# EAGLE board headstage-64_via-reduce (EAGLE 8.3.2), part 1 of 2
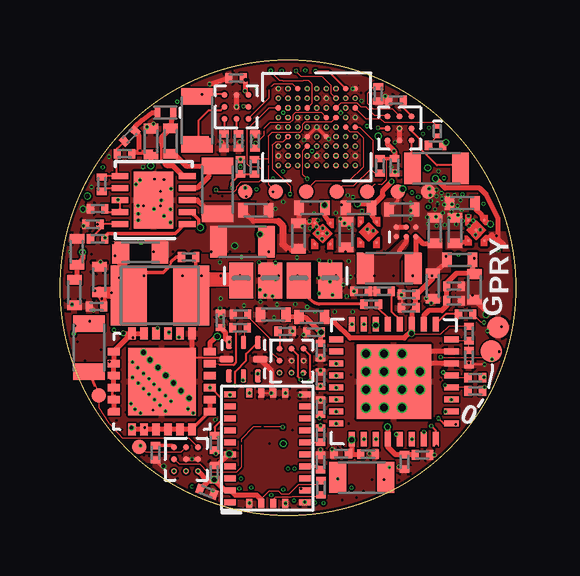
[diagram p5: board, top side]
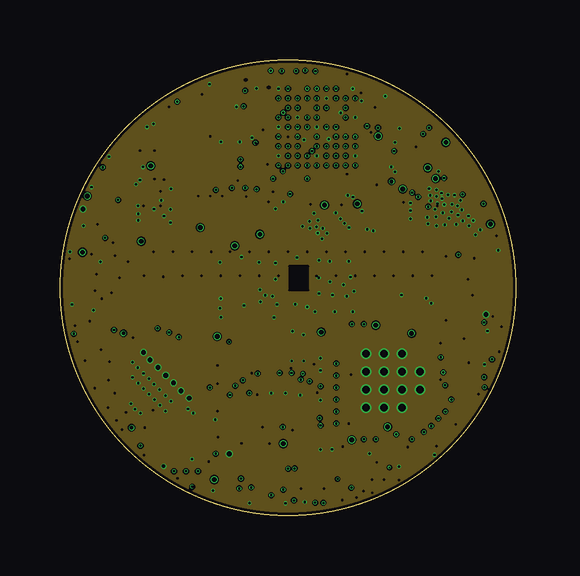
[diagram p6: board, inner layer GND1]
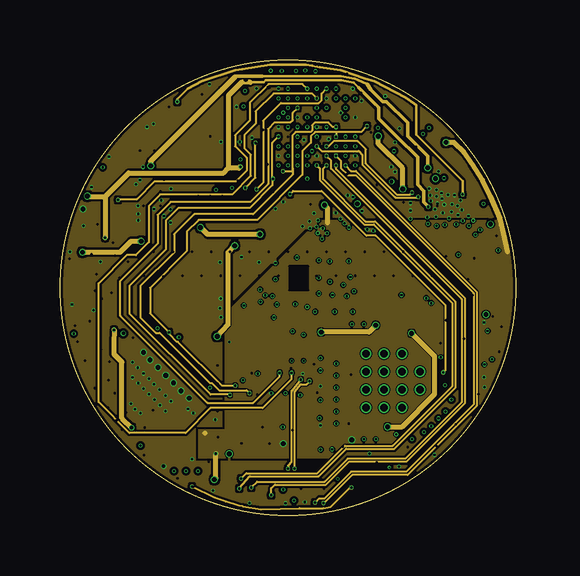
[diagram p7: board, inner layer Route2/PWR]
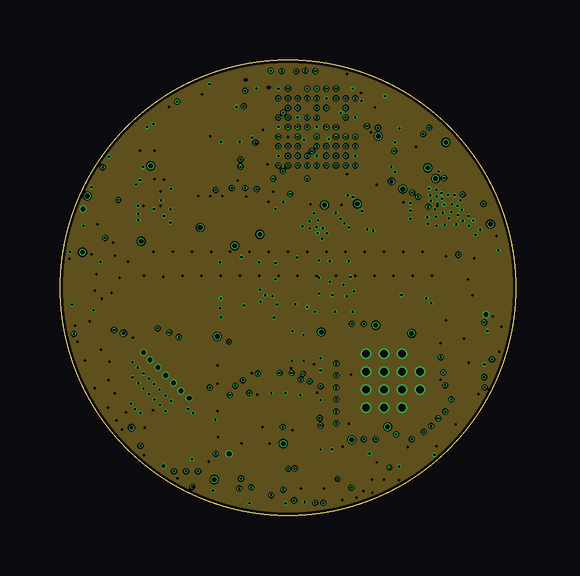
[diagram p8: board, inner layer GND2]
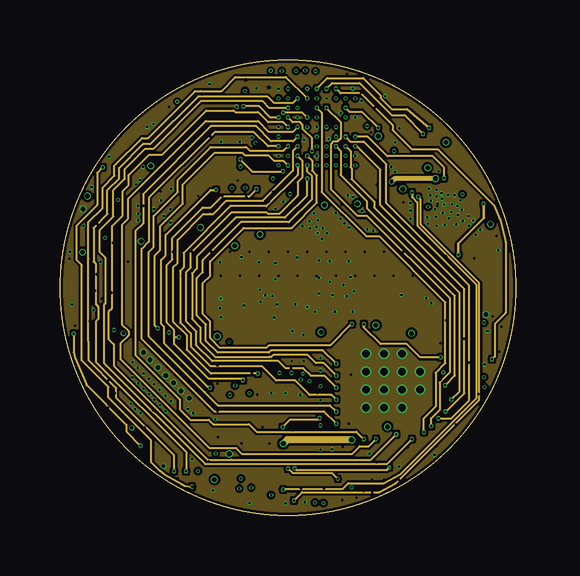
[diagram p9: board, inner layer Route3]
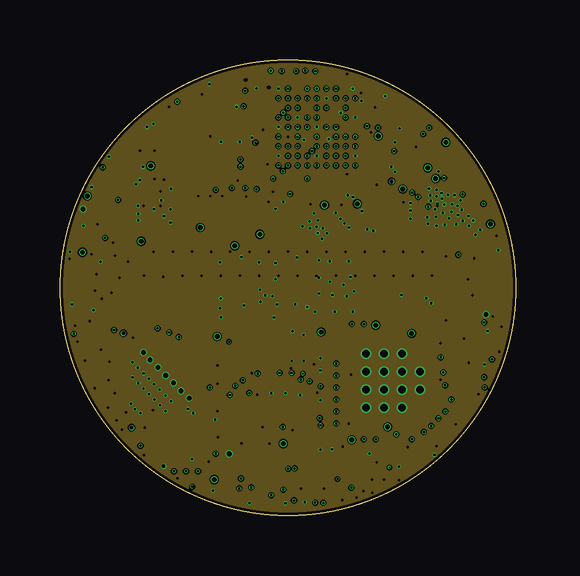
[diagram p10: board, inner layer GND3]
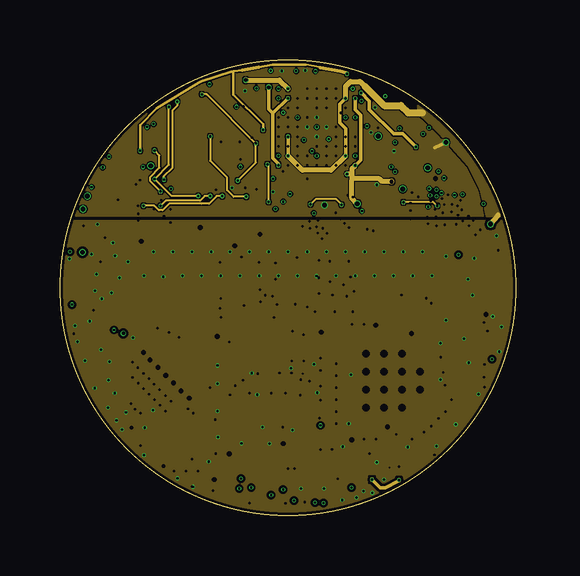
[diagram p11: board, inner layer AGND/PWR]
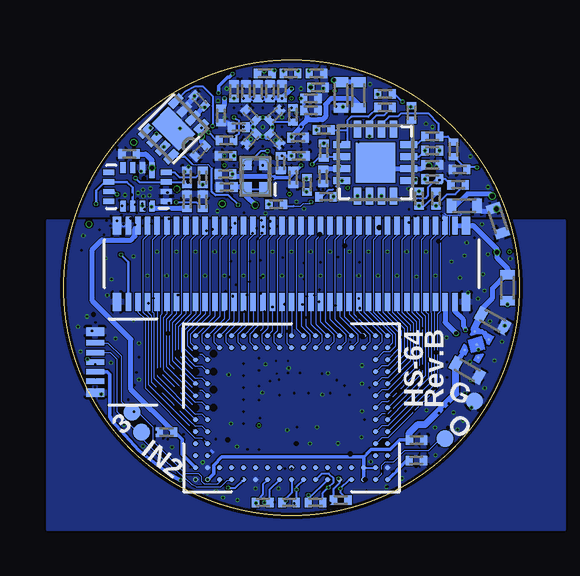
[diagram p12: board, bottom side, seen from below]

Size 19 x 19 mm. Coordinates in mm from the lower left corner, seen from the top.
Outline: circle at 9.5,9.5 radius 9.5
Copper layers ((1*2*3*4*5*6)+(7*16)): Top 0.036mm / dielectric 4mil / GND1 0.036mm / dielectric 5mil / Route2/PWR 0.036mm / dielectric 0.10921875mm / GND2 0.036mm / dielectric 5mil / Route3 0.036mm / dielectric 4mil / GND3 0.035mm / dielectric 0.15mm / AGND/PWR 0.035mm / dielectric 0.2mm / Bottom 0.036mm
Design rules "headstage-256 *": minimum track width 2mil, minimum drill 3mil, track to track 2mil, track to pad 2mil, pad to pad 2mil, via to via 2mil, smd to smd 2mil, copper to edge 5mil, drill to drill 5mil, minimum pad ring 2mil, minimum via ring 1mil, stop-mask expansion 1mil, vias tented up to drill 1mm, thermal gap 4mil
Net classes: 1 thick: width 0.1 mm; 2 diff: width 0.076 mm, drill 0.1 mm, clearance 0.051 mm
tRestrict: area 9.3,9 to 10.6,10.6; 4 lines

## Footprints (pad centres in the part's own frame; a part is rotated, then mirrored left to right if it is on the bottom)
0201T = smd 0.3 x 0.4: 1 -0.3,0; 2 0.3,0
0402T = smd 0.4 x 0.6: 1 -0.533,0; 2 0.533,0
0805PT = smd 0.7 x 1.3: A -1,0; C 1,0
LED-0201T = smd 0.2 x 0.35: 1 -0.2,0; 2 0.2,0
CLP1006-2L = smd 0.24 x 0.49: A -0.325,0; C 0.325,0
HEADSTAGE-64-DAUGHTER-CARD = smd 1 x 1.5: 1 -2.4,-0.1; 2 -1.2,-0.1; 3 0,-0.1; 4 1.3,-0.1
DF40-70HEAD-LESS-SILK = smd 0.23 x 0.75: 1 -6.8,-1.585; 2 -6.4,-1.585; 3 -6,-1.585; 4 -5.6,-1.585; 5 -5.2,-1.585; 6 -4.8,-1.585; 7 -4.4,-1.585; 8 -4,-1.585; 9 -3.6,-1.585; 10 -3.2,-1.585; 11 -2.8,-1.585; 12 -2.4,-1.585; 13 -2,-1.585; 14 -1.6,-1.585; 15 -1.2,-1.585; 16 -0.8,-1.585; 17 -0.4,-1.585; 18 0,-1.585; 19 0.4,-1.585; 20 0.8,-1.585; 21 1.2,-1.585; 22 1.6,-1.585; 23 2,-1.585; 24 2.4,-1.585; 25 2.8,-1.585; 26 3.2,-1.585; 27 3.6,-1.585; 28 4,-1.585; 29 4.4,-1.585; 30 4.8,-1.585; 31 5.2,-1.585; 32 5.6,-1.585; 33 6,-1.585; 34 6.4,-1.585; 35 6.8,-1.585; 36 6.8,1.585; 37 6.4,1.585; 38 6,1.585; 39 5.6,1.585; 40 5.2,1.585; 41 4.8,1.585; 42 4.4,1.585; 43 4,1.585; 44 3.6,1.585; 45 3.2,1.585; 46 2.8,1.585; 47 2.4,1.585; 48 2,1.585; 49 1.6,1.585; 50 1.2,1.585; 51 0.8,1.585; 52 0.4,1.585; 53 0,1.585; 54 -0.4,1.585; 55 -0.8,1.585; 56 -1.2,1.585; 57 -1.6,1.585; 58 -2,1.585; 59 -2.4,1.585; 60 -2.8,1.585; 61 -3.2,1.585; 62 -3.6,1.585; 63 -4,1.585; 64 -4.4,1.585; 65 -4.8,1.585; 66 -5.2,1.585; 67 -5.6,1.585; 68 -6,1.585; 69 -6.4,1.585; 70 -6.8,1.585 | smd 0.35 x 0.75: M1 -7.275,-1.585; M2 7.275,-1.585; M3 7.275,1.585; M4 -7.275,1.585
DF40-10HEAD_HALF = smd 0.23 x 0.75: 1 -0.8,-1.585; 2 -0.4,-1.585; 3 0,-1.585; 4 0.4,-1.585; 5 0.8,-1.585 | smd 0.35 x 0.75: M1 -1.275,-1.585; M2 1.275,-1.585
0603T = smd 0.7 x 0.9: 1 -0.82,0; 2 0.82,0
1210T = smd 1.5 x 2.5: 1 -1.3,0; 2 1.3,0
0805T = smd 0.7 x 1.3: 1 -1,0; 2 1,0
TP07R = smd 0.7 x 0.7: TP 0,0
TP09R = smd 0.9 x 0.9: TP 0,0
TP06R = smd 0.6 x 0.6: TP 0,0
CP_16_27-L = smd 0.711 x 0.305: 1 -1.397,0.75; 2 -1.397,0.25; 3 -1.397,-0.25; 4 -1.397,-0.75; 9 1.397,-0.75; 10 1.397,-0.25; 11 1.397,0.25; 12 1.397,0.75 | smd 0.305 x 0.711: 5 -0.75,-1.397; 6 -0.25,-1.397; 7 0.25,-1.397; 8 0.75,-1.397; 13 0.75,1.397; 14 0.25,1.397; 15 -0.25,1.397; 16 -0.75,1.397 | smd 1.651 x 1.651: PAD 0,0
CP_8_10-L = smd 0.635 x 0.305: 1 -0.889,0.75; 2 -0.889,0.25; 3 -0.889,-0.25; 4 -0.889,-0.75; 5 0.889,-0.75; 6 0.889,-0.25; 7 0.889,0.25; 8 0.889,0.75 | smd 0.991 x 1.6: PAD 0,0
QFN24-4X4 = smd 0.5 x 0.3: 1 -2,1.25; 2 -2,0.75; 3 -2,0.25; 4 -2,-0.25; 5 -2,-0.75; 6 -2,-1.25; 13 2,-1.25; 14 2,-0.75; 15 2,-0.25; 16 2,0.25; 17 2,0.75; 18 2,1.25 | smd 0.3 x 0.5: 7 -1.25,-2; 8 -0.75,-2; 9 -0.25,-2; 10 0.25,-2; 11 0.75,-2; 12 1.25,-2; 19 1.25,2; 20 0.75,2; 21 0.25,2; 22 -0.25,2; 23 -0.75,2; 24 -1.25,2 | smd 2.8 x 2.8: PAD 0,0
UQFN = smd 0.55 x 0.25: 1 -0.7,0.6; 3 -0.7,-0.6; 5 0.7,-0.6; 7 0.7,0.6 | smd 0.55 x 0.2: 2 -0.7,0; 6 0.7,0 | smd 0.3 x 0.6: 4 0,-0.7; 8 0,0.7
MQFN16-1.8X2.6 = smd 0.663 x 0.225: 1 -0.7,0.6 | smd 0.463 x 0.225: 2 -0.8,0.2; 3 -0.8,-0.2; 4 -0.8,-0.6; 9 0.8,-0.6; 10 0.8,-0.2; 11 0.8,0.2; 12 0.8,0.6 | smd 0.225 x 0.463: 5 -0.6,-1.2; 6 -0.2,-1.2; 7 0.2,-1.2; 8 0.6,-1.2; 13 0.6,1.2; 14 0.2,1.2; 15 -0.2,1.2; 16 -0.6,1.2
WLCSP3X3 = smd 0.25 x 0.25: A1 -0.5,0.5; A2 0,0.5; A3 0.5,0.5; B1 -0.5,0; B2 0,0; B3 0.5,0; C1 -0.5,-0.5; C2 0,-0.5; C3 0.5,-0.5
BGA104_0.5MM = smd 0.2 x 0.2: A1 -4,3; A2 -3.5,3; A3 -3,3; A4 -2.5,3; A5 -2,3; A6 -1.5,3; A7 -1,3; A8 -0.5,3; A9 0,3; A10 0.5,3; A11 1,3; A12 1.5,3; A13 2,3; A14 2.5,3; A15 3,3; A16 3.5,3; A17 4,3; B1 -4,2.5; B2 -3.5,2.5; B3 -3,2.5; B4 -2.5,2.5; B5 -2,2.5; B6 -1.5,2.5; B7 -1,2.5; B8 -0.5,2.5; B9 0,2.5; B10 0.5,2.5; B11 1,2.5; B12 1.5,2.5; B13 2,2.5; B14 2.5,2.5; B15 3,2.5; B16 3.5,2.5; B17 4,2.5; C1 -4,2; C2 -3.5,2; C16 3.5,2; C17 4,2; D1 -4,1.5; D2 -3.5,1.5; D16 3.5,1.5; D17 4,1.5; E1 -4,1; E2 -3.5,1; E16 3.5,1; E17 4,1; F1 -4,0.5; F2 -3.5,0.5; F16 3.5,0.5; F17 4,0.5; G1 -4,0; G2 -3.5,0; G16 3.5,0; G17 4,0; H1 -4,-0.5; H2 -3.5,-0.5; H16 3.5,-0.5; H17 4,-0.5; J1 -4,-1; J2 -3.5,-1; J16 3.5,-1; J17 4,-1; K1 -4,-1.5; K2 -3.5,-1.5; K16 3.5,-1.5; K17 4,-1.5; L1 -4,-2; L2 -3.5,-2; L16 3.5,-2; L17 4,-2; M1 -4,-2.5; M2 -3.5,-2.5; M3 -3,-2.5; M4 -2.5,-2.5; M5 -2,-2.5; M6 -1.5,-2.5; M7 -1,-2.5; M8 -0.5,-2.5; M9 0,-2.5; M10 0.5,-2.5; M11 1,-2.5; M12 1.5,-2.5; M13 2,-2.5; M14 2.5,-2.5; M15 3,-2.5; M16 3.5,-2.5; M17 4,-2.5; N1 -4,-3; N2 -3.5,-3; N3 -3,-3; N4 -2.5,-3; N5 -2,-3; N6 -1.5,-3; N7 -1,-3; N8 -0.5,-3; N9 0,-3; N10 0.5,-3; N11 1,-3; N12 1.5,-3; N13 2,-3; N14 2.5,-3; N15 3,-3; N16 3.5,-3; N17 4,-3
WQFN32-5X5 = smd 0.25 x 0.6: 1 1.75,2.4; 2 1.25,2.4; 3 0.75,2.4; 4 0.25,2.4; 5 -0.25,2.4; 6 -0.75,2.4; 7 -1.25,2.4; 8 -1.75,2.4; 17 -1.75,-2.4; 18 -1.25,-2.4; 19 -0.75,-2.4; 20 -0.25,-2.4; 21 0.25,-2.4; 22 0.75,-2.4; 23 1.25,-2.4; 24 1.75,-2.4 | smd 0.6 x 0.25: 9 -2.4,1.75; 10 -2.4,1.25; 11 -2.4,0.75; 12 -2.4,0.25; 13 -2.4,-0.25; 14 -2.4,-0.75; 15 -2.4,-1.25; 16 -2.4,-1.75; 25 2.4,-1.75; 26 2.4,-1.25; 27 2.4,-0.75; 28 2.4,-0.25; 29 2.4,0.25; 30 2.4,0.75; 31 2.4,1.25; 32 2.4,1.75 | smd 3.1 x 3.1: PAD 0,0
LGA-28-3.8X5.2 = smd 0.25 x 0.475: 1 -2.25,1.56; 6 -2.25,-1.56; 7 -1.75,-1.56; 8 -1.25,-1.56; 9 -0.75,-1.56; 10 -0.25,-1.56; 11 0.25,-1.56; 12 0.75,-1.56; 13 1.25,-1.56; 14 1.75,-1.56; 15 2.25,-1.56; 20 2.25,1.56; 21 1.75,1.56; 22 1.25,1.56; 23 0.75,1.56; 24 0.25,1.56; 25 -0.25,1.56; 26 -0.75,1.56; 27 -1.25,1.56; 28 -1.75,1.56 | smd 0.375 x 0.25: 2 -2.3,0.75; 3 -2.3,0.25; 4 -2.3,-0.25; 5 -2.3,-0.75; 16 2.3,-0.75; 17 2.3,-0.25; 18 2.3,0.25; 19 2.3,0.75
X2SON = smd 0.1 x 0.1: 1 -0.43,0.33; 2 -0.43,-0.33; 3 0.43,-0.33; 4 0.43,0.33 | smd 0.1 x 0.1 rotated 45: PAD 0,0
VBGA81-4X4 = smd 0.23 x 0.23: A1 1.6,1.6; A2 1.2,1.6; A3 0.8,1.6; A4 0.4,1.6; A5 0,1.6; A6 -0.4,1.6; A7 -0.8,1.6; A8 -1.2,1.6; A9 -1.6,1.6; B1 1.6,1.2; B2 1.2,1.2; B3 0.8,1.2; B4 0.4,1.2; B5 0,1.2; B6 -0.4,1.2; B7 -0.8,1.2; B8 -1.2,1.2; B9 -1.6,1.2; C1 1.6,0.8; C2 1.2,0.8; C3 0.8,0.8; C4 0.4,0.8; C5 0,0.8; C6 -0.4,0.8; C7 -0.8,0.8; C8 -1.2,0.8; C9 -1.6,0.8; D1 1.6,0.4; D2 1.2,0.4; D3 0.8,0.4; D4 0.4,0.4; D5 0,0.4; D6 -0.4,0.4; D7 -0.8,0.4; D8 -1.2,0.4; D9 -1.6,0.4; E1 1.6,0; E2 1.2,0; E3 0.8,0; E4 0.4,0; E5 0,0; E6 -0.4,0; E7 -0.8,0; E8 -1.2,0; E9 -1.6,0; F1 1.6,-0.4; F2 1.2,-0.4; F3 0.8,-0.4; F4 0.4,-0.4; F5 0,-0.4; F6 -0.4,-0.4; F7 -0.8,-0.4; F8 -1.2,-0.4; F9 -1.6,-0.4; G1 1.6,-0.8; G2 1.2,-0.8; G3 0.8,-0.8; G4 0.4,-0.8; G5 0,-0.8; G6 -0.4,-0.8; G7 -0.8,-0.8; G8 -1.2,-0.8; G9 -1.6,-0.8; H1 1.6,-1.2; H2 1.2,-1.2; H3 0.8,-1.2; H4 0.4,-1.2; H5 0,-1.2; H6 -0.4,-1.2; H7 -0.8,-1.2; H8 -1.2,-1.2; H9 -1.6,-1.2; J1 1.6,-1.6; J2 1.2,-1.6; J3 0.8,-1.6; J4 0.4,-1.6; J5 0,-1.6; J6 -0.4,-1.6; J7 -0.8,-1.6; J8 -1.2,-1.6; J9 -1.6,-1.6
DFN103X3 = smd 0.7 x 0.25: 1 -1.4,1; 2 -1.4,0.5; 3 -1.4,0; 4 -1.4,-0.5; 5 -1.4,-1; 6 1.4,-1; 7 1.4,-0.5; 8 1.4,0; 9 1.4,0.5; 10 1.4,1 | smd 1.65 x 2.38: PAD 0,0
XBGA6_1.2X0.8 = smd 0.23 x 0.23: A1 0.2,-0.4; A2 -0.2,-0.4; B1 0.2,0; B2 -0.2,0; C1 0.2,0.4; C2 -0.2,0.4
ASCO = smd 0.6 x 0.5: 1 -0.55,-0.4; 2 0.55,-0.4; 3 0.55,0.4; 4 -0.55,0.4

## Placement (x,y rotation side)
C1  0.1uF  [0201T]  8.18,14.14 270 bottom
C2  0.1uF  [0201T]  13.3,15.2 225 bottom
C3  0.1uF  [0201T]  13.34,17.3 135 bottom
C4  0.1uF  [0201T]  3.64,14.62 0 bottom
C5  0.1uF  [0201T]  6.68,8.14 90 top
C6  0.1uF  [0201T]  1.52,8.72 180 top
C7  4.7uF  [0402T]  1.64,9.84 90 top
C8  0.1uF  [0201T]  13.85,13.1 90 bottom
C9  0.1uF  [0201T]  16.27,15.08 180 bottom
C10  10nF  [0201T]  16.42,8.96 0 top
C11  0.1uF  [0201T]  16.42,9.57 0 top
C12  4.7uF  [0402T]  17.27,9.54 270 top
C13  0.1uF  [0201T]  15.1,2.53 0 top
C14  10nF  [0201T]  14.35,2.24 270 top
C15  10nF  [0201T]  14.53,8.66 180 top
C16  0.1uF  [0201T]  14.53,9.22 180 top
C17  4.7uF  [0402T]  15.53,9.57 270 top
C18  0.1uF  [0201T]  10.86,5.69 90 top
C19  1uF  [0201T]  9.38,7.68 0 top
C20  0.1uF  [0201T]  12.83,2.56 0 top
C21  10nF  [0201T]  11.72,2.58 180 top
C22  10nF  [0201T]  10.58,7.65 180 top
C23  0.1uF  [0201T]  10.86,6.88 270 top
C24  22uF  [0402T]  8.89,8.38 180 top
C25  0.1uF  [0201T]  12.97,8.82 0 top
C26  47nF  [0201T]  13.5,9.35 0 top
C27  0.1uF  [0201T]  13.94,14.58 270 top
C28  1uF  [0201T]  14,17.32 180 top
C29  10nF  [0201T]  4.3,2.3 0 bottom
C30  0.1uF  [0201T]  4.29,3.15 180 bottom
C31  0.1uF  [0201T]  6.43,1.8 90 top
C32  0.1uF  [0201T]  7.33,18.24 180 top
C33  0.1uF  [0201T]  10.86,2.22 270 top
C34  1uF  [0201T]  6.83,15.62 270 top
C35  0.1uF  [0201T]  6.12,1 340 top
C36  1uF  [0201T]  3.98,2.62 270 top
C37  1uF  [0402T]  1.12,8.13 330.9 bottom
C38  10uF  [0402T]  2.19,6.06 330.9 bottom
C39  1uF  [0402T]  9.94,11.66 90 top
C40  10uF  [0402T]  10.5,12.83 180 top
C41  1uF  [0402T]  8.16,12.73 0 top
C42  0.22uF  [0402T]  2.3,12.92 0 bottom
C43  2.2nF  [0201T]  9.2,15 0 bottom
C44  4.7nF  [0201T]  12.25,15 180 bottom
C45  10nF  [0201T]  11.9,17.7 90 bottom
C46  22nF  [0201T]  8.7,17.4 0 bottom
C47  47nF  [0201T]  8.7,16.9 0 bottom
C48  0.1uF  [0201T]  9.95,14.7 270 bottom
C49  1uF  [0201T]  9.23,15.76 0 bottom
C50  4.7nF  [0201T]  9.9,17.7 90 bottom
C51  10nF  [0201T]  10.4,17.7 90 bottom
C52  22nF  [0201T]  10.9,17.7 90 bottom
C53  0.47uF  [0201T]  11.4,17.7 90 bottom
C54  10uF  [0402T]  7.44,17.54 270 bottom
C55  1uF  [0402T]  11.92,11.72 90 top
C56  10uF  [0402T]  12.44,12.83 180 top
C57  10pF  [0201T]  2.9,15.83 45 top
C58  4.7nF  [0201T]  10.2,16.7 45 bottom
C59  10nF  [0201T]  10.2,15.7 315 bottom
C60  22nF  [0201T]  11.18,15.7 225 bottom
C61  47nF  [0201T]  11.2,16.7 135 bottom
C62  0.47uF  [0201T]  11.7,16.2 180 bottom
C63  1uF  [0402T]  4.61,15.62 90 top
C64  0.22uF  [0402T]  3.79,15.6 90 top
C65  4.7nF  [0201T]  9.43,14.1 270 bottom
C66  10nF  [0201T]  12.25,14.24 180 bottom
C67  22nF  [0201T]  8.4,17.86 0 bottom
C68  0.47uF  [0201T]  12.44,16.68 270 bottom
C69  2.2uF  [0402T]  14.24,12.76 0 top
C70  4.7uF  [0402T]  15.62,11.88 90 top
C71  10nF  [0201T]  12.2,13.7 180 bottom
C72  1uF  [0402T]  16.46,11.88 90 top
C73  22uF  [0402T]  16.76,13.03 180 top
C74  10uF  [0402T]  0.7,11 90 top
C75  10uF  [0402T]  0.6,9.3 270 top
C77  10uF  [0402T]  0.5,9.5 270 bottom
D4  VEMD1160X01  [0805PT]  12.57,1.59 0 top
D5  VEMD1160X01  [0805PT]  15.69,14.48 180 top
D6  VEMD1160X01  [0805PT]  5.71,16.48 90 top
D7  XZVGR155W  [LED-0201T]  15.72,16.03 270 top
D8  VEMD1160X01  [0805PT]  1.21,7 270 top
D9  VSKY05401006  [CLP1006-2L]  4.39,16.8 0 top
J5  [HEADSTAGE-64-DAUGHTER-CARD]  9.95,9.9 0 top
J8  DF40C-70DP-0.4V(51)  [DF40-70HEAD-LESS-SILK]  9.5,10.5 0 bottom
J9  [DF40-10HEAD_HALF]  16.1,6.4 270 bottom
L2  BLM18KG601SN1D  [0603T]  3.35,10.97 0 top
L4  CBC3225T101MR  [1210T]  4.16,9.18 180 top
L6  BLM15PX601SN1D  [0402T]  16.66,10.66 0 top
L7  BLM15PX601SN1D  [0402T]  0.9,12.3 287.8 bottom
L8  BLM15PX601SN1D  [0402T]  10.49,8.28 180 top
L9  MLZ2012M100WT000  [0805T]  7.6,11.42 180 top
L10  BLM15PX601SN1D  [0402T]  6.72,17.54 90 bottom
L11  MLZ2012M100WT000  [0805T]  6.56,13.58 270 top
L12  LQM21PN1R0NGRD  [0805T]  13.72,10.31 180 top
R1  9k, 0.1%  [0201T]  8.16,15.22 90 bottom
R2  1k, 0.1%  [0201T]  8.06,13.3 180 bottom
R4  10k, 0.1%  [0201T]  10.14,12.98 0 bottom
R5  10k, 0.1%  [0201T]  8.16,16.08 0 bottom
R6  10k, 0.1%  [0201T]  4.51,16.79 90 bottom
R7  10k, 0.1%  [0201T]  3.64,15.81 180 bottom
R8  10k, 0.1%  [0201T]  3.64,14.03 180 bottom
R10  1k  [0201T]  5.36,10.78 180 top
R11  10k, 0.1%  [0201T]  5.61,17.02 0 bottom
R12  100  [0201T]  5.61,17.58 180 bottom
R13  2.86k  [0201T]  2.56,13.8 180 bottom
R14  10k, 0.1%  [0201T]  2.75,15.27 90 bottom
R15  590  [0201T]  7.5,7.83 0 top
R16  10k, 0.1%  [0201T]  3.48,13.22 270 bottom
R17  10k, 0.1%  [0201T]  4.19,13.22 270 bottom
R18  10k, 0.1%  [0201T]  3.64,15.22 180 bottom
R19  10k, 0.1%  [0201T]  2.5,14.43 0 bottom
R21  1k  [0201T]  13.2,13.1 270 bottom
R22  10k  [0201T]  13.2,14.1 90 bottom
R23  10k  [0201T]  13.85,14.11 90 bottom
R24  15k  [0201T]  7.52,8.4 0 top
R25  49.9  [0201T]  12.55,9.35 0 top
R26  15k  [0201T]  13.26,17.58 90 top
R27  10k  [0201T]  17.04,7.59 270 top
R28  10k  [0201T]  10.87,1.16 270 top
R29  0  [0201T]  14.71,3.48 0 bottom
R30  100k  [0201T]  17.04,6.59 270 top
R31  100  [0201T]  10.7,0.55 0 bottom
R32  10k  [0201T]  10.86,3.36 90 top
R33  10k  [0201T]  16.9,8.4 180 top
R34  100  [0201T]  9.6,0.55 0 bottom
R35  100  [0201T]  8.5,0.55 180 bottom
R36  15k  [0201T]  7.44,15.62 90 top
R37  2k  [0201T]  15.65,15.44 180 top
R38  10k  [0201T]  12.22,15.64 0 bottom
R39  10k  [0201T]  8.1,14.54 90 top
R40  10k  [0201T]  13.33,14.58 270 top
R41  4.7k  [0201T]  7.52,14.55 270 top
R42  15k  [0201T]  10.86,4.52 270 top
R43  1k  [0201T]  8.12,15.62 90 top
R44  4.7k  [0201T]  17.3,5.2 180 top
R45  1M  [0201T]  1.57,11.54 0 top
R46  90.9k  [0201T]  1.37,12.14 0 top
R47  100  [0201T]  7.45,0.65 0 bottom
R48  83.3k  [0201T]  1.74,13.82 270 top
R49  10k  [0201T]  1.57,12.8 180 top
R50  1M  [0201T]  2.69,15.09 180 top
R51  4.7k  [0201T]  8.85,13.8 270 bottom
R52  4.7k  [0201T]  17.3,5.75 180 top
R53  10k  [0201T]  6.44,3.03 90 top
R54  10k  [0201T]  9.44,16.71 90 bottom
R55  10k  [0201T]  9.54,18.44 180 bottom
R56  10k  [0201T]  10.62,18.44 180 bottom
R57  10k  [0201T]  8.46,18.44 0 bottom
TP1  VCC  [TP07R]  1.88,4.77 0 bottom
TP2  VCC  [TP07R]  3.1,3.2 0 bottom
TP3  [TP09R]  18.25,7.85 0 top
TP4  [TP09R]  17.98,6.85 0 top
TP5  VCC  [TP07R]  16.15,4.31 0 bottom
TP6  VCC  [TP07R]  15.76,3.49 0 bottom
TP7  [TP06R]  1.62,5.02 0 top
TP8  [TP06R]  3.3,2.86 0 top
TP9  [TP06R]  14.07,13.51 0 top
TP10  [TP06R]  8.99,13.51 270 top
TP11  [TP06R]  7.72,13.51 270 top
TP12  [TP06R]  11.53,13.51 270 top
TP13  [TP06R]  10.26,13.51 270 top
TP14  gnd  [TP06R]  12.8,13.51 270 top
TP15  VCC  [TP06R]  15.34,13.51 270 top
U1  ADA4062-4ACPZ-R7  [CP_16_27-L]  6.01,14.72 0 bottom
U2  AD5681RBCPZ-1RL7  [CP_8_10-L]  14.42,16.13 225 bottom
U3  CAT4016_QFN  [QFN24-4X4]  4.25,5.59 270 top
U4  TPL0501_UQFN  [UQFN]  7.64,6.52 90 top
U5  DG509B  [MQFN16-1.8X2.6]  15.92,13.71 270 bottom
U6  TS4231  [WLCSP3X3]  9.65,6.45 0 top
U7  RHD2064_BGA  [BGA104_0.5MM]  9.5,4.5 0 bottom
U8  TS4231  [WLCSP3X3]  14.15,16.15 270 top
U9  [WQFN32-5X5]  13.91,5.59 270 top
U10  BNO055  [LGA-28-3.8X5.2]  8.64,2.81 90 top
U11  TS4231  [WLCSP3X3]  7.35,17.05 90 top
U12  TS4231  [WLCSP3X3]  5.25,2.35 0 top
U13  TLV70733  [X2SON]  1.79,7.13 60.9 bottom
U14  10M08DC  [VBGA81-4X4]  10.7,16.2 0 top
U15  TLV70733  [X2SON]  10.94,11.76 270 top
U16  LT3463  [DFN103X3]  3.9,13.16 180 top
U17  TLV70725  [X2SON]  12.86,11.82 270 top
U18  TPS62621  [XBGA6_1.2X0.8]  14.42,11.84 270 top
U19  ASCO-50.000MHZ-EK-T3  [ASCO]  11,14.15 90 bottom
U20  TLV70712  [X2SON]  17.34,11.9 270 top

## Tracks (layer width: path | path; a pad name or v marks a point on that pad's centre or on a via)
!IMU_BL
  Top 0.051: R28.2 10.87,0.81 10.16,0.81 9.68,0.81 9.64,0.78 8.99,0.78 8.89,0.67 U10.4
!IMU_RESET
  Top 0.076: U10.11 R32.1
$N324  (via drill 0.1, 0.15 layers 7-16)
  AGND/PWR 0.2: v7.74,18.16 9.14,18.16 U14.A8
  Bottom 0.2: C53.1 C52.1 C51.1 C50.1 U14.A8 | L10.2 C54.1 v7.74,18.16
  other vias: 9.5,17.8
  pour Bottom (no thermals): 9.42,17.8 arc180 9.58,17.8 arc180
  pour AGND/PWR (no thermals): 9.42,17.8 arc180 9.58,17.8 arc180
  pour AGND/PWR (no thermals): 7.64,18.16 arc180 7.84,18.16 arc180
  pour Bottom (no thermals): 7.64,18.16 arc180 7.84,18.16 arc180
+1V2  (via drill 0.1, 0.1 layers 7-16, 0.2)
  Top 0.2: v17.94,12.15 v17.94,12.16 U20.1 17.58,12.5 17.29,12.79 C73.1
  AGND/PWR 0.15: C43.1 v9.5,15.8 | C45.1 11.66,17.16 11.66,16.38 11.9,16.14 U14.H2
  AGND/PWR 0.2: v17.94,12.15 18.25,12.5 18.25,12.54 | U14.H2 11.3,14.4 10.1,14.4 C43.1 | C45.1 11.9,17.9 12.1,18.1 12.48,18.1 12.5,18.1 12.7,17.9
  AGND/PWR 0.3: 15.1,16.8 14.5,16.8 14.2,17.1 13.5,17.1 12.7,17.9
  Bottom 0.076: C46.1 U14.B9 | C44.1 U14.H2 | C49.1 v9.5,15.8
  Bottom 0.1: U14.B9 C46.1
  Bottom 0.15: C48.1 C43.1 | C47.1 C46.1
  Bottom 0.2: 9.02,16.82 C47.1 8.87,16.77 8.87,16.52 8.85,16.52 | 6.64,17.08 L10.1 | 6.64,17.08 6.63,17.09 | 8.85,16.52 8.75,16.52 8.41,16.51 8.21,16.51 8.08,16.64 8.08,17.15 7.84,17.4 6.98,17.4 6.65,17.08 6.64,17.08 | C49.1 9.18,16.11 9.09,16.2 9.09,16.27 8.85,16.52
  other vias: 9.5,15 11.9,17.4 9.1,17.4 11.9,15
  pour AGND/PWR (rank 2): 18.7,12.5 18.7,14.25 15.5,17.45 14.9,17.45 14.9,17.05 14.9,16.8 15.8,15.95 17,14.6 17.5,13.6 17.75,12.5
  pour AGND/PWR (no thermals): 9.42,15 arc180 9.58,15 arc180
  pour Bottom (no thermals): 9.42,15 arc180 9.58,15 arc180
  pour AGND/PWR (no thermals): 9.42,15 arc180 9.58,15 arc180
  pour AGND/PWR (no thermals): 11.82,17.4 arc180 11.98,17.4 arc180
  pour AGND/PWR (no thermals): 11.82,17.4 arc180 11.98,17.4 arc180
  pour AGND/PWR (no thermals): 9.42,15.8 arc180 9.58,15.8 arc180
  pour Bottom (no thermals): 9.42,15.8 arc180 9.58,15.8 arc180
  pour AGND/PWR (no thermals): 17.81,12.15 arc180 18.07,12.15 arc180
  pour Top (no thermals): 17.81,12.15 arc180 18.07,12.15 arc180
  pour Bottom (no thermals): 9.02,17.4 arc180 9.18,17.4 arc180
  pour AGND/PWR (no thermals): 11.82,15 arc180 11.98,15 arc180
  pour AGND/PWR (no thermals): 11.82,15 arc180 11.98,15 arc180
  pour Bottom (no thermals): 11.82,15 arc180 11.98,15 arc180
+1V8  (via drill 0.2 layers 1-6)
  Top 0.051: R27.1 16.19,7.89 15.85,7.55 14.7,7.55 v14.65,7.6
  Top 0.15: 14.82,10.44 L12.1 14.83,10.35
  Top 0.2: 15.51,11.35 15.48,11.32 C70.1 15.11,11.35 U18.C1 14.82,10.46 L12.1 | U9.11 14.66,8.49 C15.1 C16.1 14.87,9.22 15.53,9.88 C17.1 16.09,10.56 L6.1 | U9.11 14.65,7.98 14.65,7.7 14.35,7.4 12.08,7.4 11.45,8.03 L8.1 | v13.65,3.7 v13.66,3.69 U9.28 13.66,2.86 13.98,2.54 C14.1 C13.1 | U9.11 v14.65,7.6
  Route2/PWR 0.2: v14.65,7.6 15.61,6.64 15.61,5.06 14.25,3.7 v13.65,3.7
  pour Top (rank 2, no thermals): 15.34,10.18 16.25,10.18 16.25,10.9 15.9,10.9 15.9,11.8 15.34,11.8
  pour Route2/PWR (no thermals): 14.52,7.6 arc180 14.78,7.6 arc180
  pour Top (no thermals): 14.52,7.6 arc180 14.78,7.6 arc180
  pour Top (no thermals): 14.52,7.6 arc180 14.78,7.6 arc180
  pour Route2/PWR (no thermals): 13.52,3.7 arc180 13.78,3.7 arc180
  pour Top (no thermals): 13.52,3.7 arc180 13.78,3.7 arc180
+2V5  (via drill 0.1, 0.1 layers 7-16, 0.15 layers 1-6, 0.15 layers 7-16, 0.2, 0.2 layers 1-6)
  Top 0.15: 12.8,13 C56.1
  Top 0.2: C56.1 12.97,12.56 U17.1 | 12.8,13 v12.39,13 | C72.1 16.58,11.35 U20.3 | C56.1 12.97,12.97 | U20.4 17.86,11.57 17.99,11.71 18.4,11.3 18.5,11.3 18.25,11.55 18.25,12.4 17.75,13.39 17.49,13.65 16.05,13.65 v15.65,14.05 | C56.1 12.97,12.87 13.45,13.35 13.45,13.56 v13.82,13.93
  Route3 0.2: v13.82,13.93 13.94,14.05 v15.65,14.05
  AGND/PWR 0.1: U14.J1 12.36,14.66 | 12.36,14.66
  AGND/PWR 0.15: U14.B1 12.3,16.92 12.53,16.69 12.53,14.83 12.36,14.66 U14.J1 | U14.J9 9.1,14.68 8.87,14.91 8.87,16.77 | 8.87,16.77 U14.B8 | C67.1 8.7,16.95 8.87,16.77
  AGND/PWR 0.2: v12.39,13 12.16,13.23 12.16,14 | v13.82,13.93 13.43,13.93 13.3,14.05 12.21,14.05 arc90 12.16,14 | 12.16,14.24 12.16,14 | 12.16,14.24 v11.96,14.24 | U14.J1 12.16,14.46 12.16,14.24
  Bottom 0.15: v11.96,14.24 C66.1 | U14.J9 9.32,14.38 9.42,14.28 C65.1
  Bottom 0.152: 9.32,14.38 9.6,14.1 10.21,14.1
  Bottom 0.2: 10.21,14.1 10.35,14.1 10.4,14.15 11.86,14.15 C66.1 | U14.B1 12.3,17.12 C68.1
  other vias: 9.5,17.4 12.3,17.4 9.1,14.6 8.7,17.86 12.3,14.6
  pour Top (isolate 0.1, rank 3, no thermals): 16.1,11.8 16.1,11.06 19.3,11.06 19.3,11.8
  pour AGND/PWR (no thermals): 9.42,17.4 arc180 9.58,17.4 arc180
  pour AGND/PWR (no thermals): 12.22,17.4 arc180 12.38,17.4 arc180
  pour Bottom (no thermals): 12.22,17.4 arc180 12.38,17.4 arc180
  pour Bottom (no thermals): 11.88,14.24 arc180 12.04,14.24 arc180
  pour AGND/PWR (no thermals): 11.88,14.24 arc180 12.04,14.24 arc180
  pour AGND/PWR (no thermals): 9.02,14.6 arc180 9.18,14.6 arc180
  pour Bottom (no thermals): 9.02,14.6 arc180 9.18,14.6 arc180
  pour Top (no thermals): 12.26,13 arc180 12.52,13 arc180
  pour AGND/PWR (no thermals): 12.26,13 arc180 12.52,13 arc180
  pour AGND/PWR (no thermals): 8.6,17.86 arc180 8.8,17.86 arc180
  pour Top (no thermals): 13.72,13.93 arc180 13.92,13.93 arc180
  pour AGND/PWR (no thermals): 13.72,13.93 arc180 13.92,13.93 arc180
  pour Route3 (no thermals): 13.72,13.93 arc180 13.92,13.93 arc180
  pour Top (no thermals): 15.52,14.05 arc180 15.78,14.05 arc180
  pour Route3 (no thermals): 15.52,14.05 arc180 15.78,14.05 arc180
  pour AGND/PWR (no thermals): 12.22,14.6 arc180 12.38,14.6 arc180
+3V3  (via drill 0.08 layers 1-6, 0.1, 0.1 layers 1-6, 0.1 layers 7-16, 0.2, 0.2 layers 1-6)
  Top 0.051: v16.08,15.56 15.96,15.49 R37.1 | TP14.TP 13.09,13.8 13.4,13.8 13.62,14.02 13.62,14.88 13.58,14.88 | R52.1 v17.67,5.77 | R44.1 v17.69,5.35 | v17.67,8.05 17.55,8.05 R33.1 | R39.1 | U10.3 8.39,0.69 8.73,1.03 9.1,1.03 9.23,0.9 9.55,0.9 9.95,1.3 10.71,1.3 R28.1
  Top 0.076: C40.1 11.03,12.95 v11.02,12.95 | v12.16,3.16 U9.25 | U6.C3 v10.12,5.92 | R39.1 R41.2 7.16,13.89 v7.16,13.66 | C5.1 6.68,7.86 | U4.7 v7.05,7.23 v7.05,7.24 | R32.2 v10.86,3.76 | U12.C3
  Top 0.15: C27.1 13.58,14.88 R40.1 | v7.71,17.71 7.85,17.57 U11.C3 | U10.28 7,1.06 | U10.3 8.38,0.53
  Top 0.2: C40.1 11.03,12.52 U15.1 | U8.C3 13.65,15.47 v13.92,15.2 13.94,15.18 C27.1 | C32.1 7.71,18.16 v7.71,17.71 | C31.1 6.87,1.06 U10.28 7.29,0.85 8.2,0.85 8.39,0.66 U10.3 | C35.1 6.23,1.5 C31.1 | U12.C3 6.1,1.5 C31.1 | R53.1 6.49,2.68 v6.49,2.58 | C5.1 6.9,7.62 6.9,7.36 U4.7 | U9.25 12.16,2.58 C21.1 12.02,2.56 C20.1
  Route2/PWR 0.2: v11.02,12.95 11.15,12.82 11.15,12.2 | 18.38,12.12 18.32,12.38 17.93,13.31 17.59,14 17.16,14.68 16.84,15.13 16.41,15.56 v16.08,15.56 | 18.38,12.12 | 18.38,12.12 18.64,10.99 | 6.04,3.43 6.04,3.44 | C31.1 6.49,1.56 v6.49,2.58
  Route3 0.3: v12.16,3.16 9.46,3.16 v9.3,3
  AGND/PWR 0.15: v16.08,15.56 15.62,15.34
  Bottom 0.076: 10.68,15.8 U14.F5 10.86,15.8 C60.1 10.88,15.8 | U14.D5 10.88,16.6 C61.1 10.9,16.58 10.9,16.6 | U14.E6 10.3,16.18 | U14.E4 11.1,16.22 | R56.1 v10.22,18.56 | R55.1 v9.24,18.54 | 10.34,16.41 9.98,16.41 R54.1 | U19.1 U19.4 | v12.96,15.98 12.62,15.64 R38.1 | R51.2 v8.88,13.5
  Bottom 0.15: U14.E6 10.3,16.38 10.34,16.41 C58.1 | 10.52,16.6 U14.D5 | 10.72,16.6 10.9,16.6 | 11.1,16.22 11.1,16.4 | 11.1,16.02 U14.E4 | U14.F5 10.88,15.8 | 10.5,15.8 10.52,15.8 | 10.68,15.8 10.52,15.8 | 10.3,16 10.3,16.18 | 10.52,15.8 C59.1
  Bottom 0.2: U14.E4 C62.1 | C59.1 10.55,15.77 | C71.1 11.5,13.7 U19.4 11.4,13.33 v11.02,12.95 | U2.2 13.09,17.11 C3.1 v13.13,17.03 v13.12,17.02
  other vias: 11.1,16.2 10.3,16.2 10.7,16.6 10.7,15.8 13.2,13.8 5.75,1.85 10.86,5.39 6.43,1.5
  pour AGND/PWR (isolate 0.05, rank 3, no thermals): -0.6,12.5 -0.6,13.33 5.37,19.3 13.64,19.3 19.8,13.14 19.8,12.5
  pour Route2/PWR (isolate 0.02, rank 3): 20.9,2.4 5.8,2.4 5.8,3.58 6.9,3.58 6.9,8.4 10.8,12.3 20.9,12.3
  pour Bottom (no thermals): 11.02,16.2 arc180 11.18,16.2 arc180
  pour Bottom (no thermals): 11.02,16.2 arc180 11.18,16.2 arc180
  pour Bottom (no thermals): 11.02,16.2 arc180 11.18,16.2 arc180
  pour Bottom (no thermals): 10.22,16.2 arc180 10.38,16.2 arc180
  pour Bottom (no thermals): 10.22,16.2 arc180 10.38,16.2 arc180
  pour Bottom (no thermals): 10.62,16.6 arc180 10.78,16.6 arc180
  pour Bottom (no thermals): 10.62,16.6 arc180 10.78,16.6 arc180
  pour Bottom (no thermals): 10.62,15.8 arc180 10.78,15.8 arc180
  pour Bottom (no thermals): 10.62,15.8 arc180 10.78,15.8 arc180
  pour Bottom (no thermals): 10.62,15.8 arc180 10.78,15.8 arc180
  pour AGND/PWR (no thermals): 15.95,15.56 arc180 16.21,15.56 arc180
  pour Top (no thermals): 15.95,15.56 arc180 16.21,15.56 arc180
  pour Route2/PWR (no thermals): 15.95,15.56 arc180 16.21,15.56 arc180
  pour Bottom (no thermals): 10.14,18.56 arc180 10.3,18.56 arc180
  pour Bottom (no thermals): 9.16,18.54 arc180 9.32,18.54 arc180
  pour Top (no thermals): 13.84,15.2 arc180 14,15.2 arc180
  pour Top (no thermals): 13.84,15.2 arc180 14,15.2 arc180
  pour Bottom (no thermals): 12.88,15.98 arc180 13.04,15.98 arc180
  pour Top (no thermals): 10.89,12.95 arc180 11.15,12.95 arc180
  pour Route2/PWR (no thermals): 10.89,12.95 arc180 11.15,12.95 arc180
  pour Bottom (no thermals): 10.89,12.95 arc180 11.15,12.95 arc180
  pour Top (no thermals): 12.03,3.16 arc180 12.29,3.16 arc180
  pour Route3 (no thermals): 12.03,3.16 arc180 12.29,3.16 arc180
  pour Top (no thermals): 17.59,5.77 arc180 17.75,5.77 arc180
  pour Top (no thermals): 17.61,5.35 arc180 17.77,5.35 arc180
  pour Top (no thermals): 17.59,8.05 arc180 17.75,8.05 arc180
  pour Route2/PWR (no thermals): 6.41,2.58 arc180 6.57,2.58 arc180
  pour Top (no thermals): 6.41,2.58 arc180 6.57,2.58 arc180
  pour Top (no thermals): 7.63,17.71 arc180 7.79,17.71 arc180
  pour Top (no thermals): 7.63,17.71 arc180 7.79,17.71 arc180
  pour Bottom (no thermals): 13.04,17.02 arc180 13.2,17.02 arc180
  pour Top (no thermals): 7.08,13.66 arc180 7.24,13.66 arc180
  pour Top (no thermals): 5.67,1.85 arc180 5.83,1.85 arc180
  pour Top (no thermals): 6.99,7.24 arc180 7.11,7.24 arc180
  pour Top (no thermals): 10.05,5.92 arc180 10.18,5.92 arc180
  pour Bottom (no thermals): 8.8,13.5 arc180 8.96,13.5 arc180
  pour Top (no thermals): 6.3,1.5 arc180 6.56,1.5 arc180
  pour Route2/PWR (no thermals): 6.3,1.5 arc180 6.56,1.5 arc180
  pour Top (no thermals): 6.3,1.5 arc180 6.56,1.5 arc180
  pour Top (no thermals): 6.3,1.5 arc180 6.56,1.5 arc180
  pour Top (no thermals): 10.78,3.76 arc180 10.94,3.76 arc180
  pour Route3 (no thermals): 9.17,3 arc180 9.43,3 arc180
+3V3_AN  (via drill 0.1 layers 7-16)
  AGND/PWR 0.15: U7.N2 13.35,1.15 13.55,1.15 14.11,1.46 v14.12,1.47
  Bottom 0.076: U7.M15 U7.M16
  Bottom 0.15: 6.5,2.44 12.41,2.44 12.75,2.1 12.75,1.75 U7.N2 | v14.12,1.47 14.14,1.47 14.64,1.75 15.35,2.31 15.86,2.72 16.8,3.75 | 16.8,3.75 | 16.8,3.75 16.9,3.87 17.07,4.14 | J9.4 17.18,6 17.07,5.89 17.07,4.14 | 17.07,4.14 | 17.07,4.14
  Bottom 0.152: C30.2 4.99,3.15 5.38,2.76 6.18,2.76 6.5,2.44 U7.M15 U7.N15
  Bottom 0.2: U13.1 C38.1
  Bottom 0.3: C38.1 2.65,5.09 3.94,3.8 4.24,3.8 4.59,3.45 C30.2
  other vias: 13,1.5
  pour AGND/PWR (no thermals): 14.05,1.47 arc180 14.2,1.47 arc180
  pour Bottom (no thermals): 14.05,1.47 arc180 14.2,1.47 arc180
  pour Bottom (no thermals): 12.92,1.5 arc180 13.08,1.5 arc180
  pour AGND/PWR (no thermals): 12.92,1.5 arc180 13.08,1.5 arc180
+15V0  (via drill 0.1, 0.1 layers 1-6, 0.2)
  Top 0.076: R45.2 v1.88,11.58
  Top 0.15: 5.2,12.16 4.8,11.76 1.99,11.76 R45.2
  Top 0.2: U16.1 5.2,12.16
  Route2/PWR 0.1: v15.34,12.88 15.34,12.87 | 12.45,17.85 12.24,18.06 11.72,18.16 8.58,18.16 8.49,18.07 7.93,18.07
  Route2/PWR 0.15: v15.34,12.88 15.16,13.06 15.16,13.54 14.9,13.8 14.9,14.94 14.05,15.79 13.28,16.56 13.28,17.02 12.45,17.85
  Route2/PWR 0.2: 1.88,13.3 v1.88,11.58 | 7.02,14.48 6.82,14.28 2.86,14.28 1.88,13.3 | 7.93,18.07 7.57,18.07 7.02,17.52 7.02,14.48 | v7.52,14.55 7.45,14.48 7.02,14.48 | v1.14,13.32 1.16,13.3 1.88,13.3
  Bottom 0.076: v15.34,12.88 U5.12
  Bottom 0.2: C8.1 15.26,12.8 arc90 v15.34,12.88 | v1.14,13.32 1.23,13.41 2.17,13.41 2.66,12.92 C42.1 | C1.1 8.15,14.47 U1.3 7.49,14.55 v7.52,14.55
  pour Top (no thermals): 1.8,11.58 arc180 1.96,11.58 arc180
  pour Route2/PWR (no thermals): 1.8,11.58 arc180 1.96,11.58 arc180
  pour Route2/PWR (no thermals): 15.27,12.88 arc180 15.42,12.88 arc180
  pour Bottom (no thermals): 15.27,12.88 arc180 15.42,12.88 arc180
  pour Bottom (no thermals): 15.27,12.88 arc180 15.42,12.88 arc180
  pour Route2/PWR (no thermals): 15.27,12.88 arc180 15.42,12.88 arc180
  pour Route2/PWR (no thermals): 7.44,14.55 arc180 7.6,14.55 arc180
  pour Bottom (no thermals): 7.44,14.55 arc180 7.6,14.55 arc180
  pour Bottom (no thermals): 1.01,13.32 arc180 1.27,13.32 arc180
  pour Route2/PWR (no thermals): 1.01,13.32 arc180 1.27,13.32 arc180
-15V0  (via drill 0.2)
  Top 0.2: 3.63,15.15 C64.1 | 3.56,15.15 C64.1 | D9.A 3.84,16.8 3.4,16.47 3.11,16.19 C57.2 3.28,15.87 3.28,15.16 | C64.1 3.79,14.59 v3.78,14.59 | C64.1 3.79,15.16 3.28,15.16 | R50.1 3.06,15.16 3.28,15.16
  Route2/PWR 0.1: 12.81,17.99 12.38,18.18 12.27,18.21 11.7,18.33 8.43,18.33 | 7.4,18.33 7.3,18.33
  Route2/PWR 0.15: v15.32,14.5 15.32,14.98 14.48,15.82 14.48,16.38 13.6,17.26 13.46,17.26 12.95,17.77 12.81,17.99 | 8.43,18.33 7.4,18.33 7.33,18.33 7.3,18.3
  Route2/PWR 0.2: 7.3,18.3 6.77,17.77 3.78,14.78 v3.78,14.59
  Bottom 0.076: U5.1
  Bottom 0.1: 15.31,14.56 U5.1
  Bottom 0.15: U5.1 v15.32,14.5
  Bottom 0.2: C9.1 15.58,15.08 15.32,14.82 v15.32,14.5 | U1.PAD 5.76,14.47 U1.10 4.09,14.47 v3.78,14.59 3.9,14.59 C4.1
  pour Bottom (no thermals): 15.19,14.5 arc180 15.45,14.5 arc180
  pour Bottom (no thermals): 15.19,14.5 arc180 15.45,14.5 arc180
  pour Route2/PWR (no thermals): 15.19,14.5 arc180 15.45,14.5 arc180
  pour Bottom (no thermals): 3.65,14.58 arc180 3.91,14.58 arc180
  pour Top (no thermals): 3.65,14.58 arc180 3.91,14.58 arc180
  pour Route2/PWR (no thermals): 3.65,14.58 arc180 3.91,14.58 arc180
  pour Bottom (no thermals): 3.65,14.58 arc180 3.91,14.58 arc180
AGND  (via drill 0.1 layers 7-16)
  Bottom 0.127: 16.79,12.1 J8.M4 J8.70 | J8.M1 16.79,8.9 | 2.21,8.9 J8.M2 | 12.84,2.7 12.78,2.64
  Bottom 0.15: 17.43,5.12 v17.43,5.07
  other vias: 3.5,2.52 10.05,1.12 2.59,3.59 3.53,3.67 1.71,6.91 1.04,6.46 2.06,6.42 0.73,7.25 1.46,9.38 1.52,10.06 0.39,10.71 2.3,10.84 2.48,9.92 1.32,10.9 2.2,11.38 2,4.5 18.03,8.3 18.4,7.87 18.3,6.83 16.08,10.82 1.24,8.1 1.74,9.04 2.84,10.58 5.54,1.2 11.76,0.64 11,1.12 12.35,0.75 3.5,10 3.9,11 4.3,9.96 4.7,11 5.1,10 5.5,11 5.9,10 6.3,11 7.09,11 7.9,11 8.7,11 10.3,11 9.5,11 11.1,11 11.9,11 12.7,11 13.5,11 14.3,11 15.1,11 6.7,10 7.5,10 8.3,10 9.1,10 9.9,10 10.69,9.99 12.3,10 13.1,10 13.9,10 14.7,10 15.5,10 12.64,1.02 17.18,9.18 17,9.86 16.08,8.14 18.18,11.66 0.62,7.91 2.02,5.65 1.56,12.14 3.04,7.42 2.15,9.29 6.57,6.26 6.56,5.5 6.57,4.35 6.58,3.27 7.57,3.01 8.73,3 9.68,3.56 8.44,3.69 10.58,6.31 9.62,6.14 17.26,10.73 4.9,1.55 13.2,2.22 13.5,1.5 11.5,10 1.45,5.31 2.35,3.97 3.88,4.4 2.28,5.1 17.03,6.37 12.03,3.84 12.12,5.87 10.72,5.12 11.78,2.87 8.22,5.04 7.99,5.94 15.86,5.66 15.85,7.19 14.49,2.85 2.75,4.3 15.69,2.9 16.49,3.8 16.83,7.37 13.01,0.95 6.2,2.25
  pour AGND/PWR (isolate 0.1, rank 3): -0.6,12.3 19.8,12.3 19.8,-0.1 -0.6,-0.1
  pour Bottom (isolate 0.05, rank 3): -1.9,12.3 19.7,12.3 19.7,-0.6 -1.9,-0.6
  pour Bottom (no thermals): 17.35,5.07 arc180 17.51,5.07 arc180
AUXIN2
  Bottom 0.051: U7.N4 12.03,1.47 12.17,1.47 12.45,1.2 13.48,1.2 13.64,1.29 | 13.73,1.37 13.66,1.3 13.64,1.29 | 13.64,1.29 13.73,1.37 | J9.2 17.05,6.8 16.77,6.53 16.77,4.34 15.93,3.49 TP6.TP 15.86,3.34 15.05,2.53 13.73,1.37
AUXIN3
  Bottom 0.051: U7.N3 12.5,1.4 12.6,1.3 13.12,1.3 13.25,1.43 13.25,1.61 13.37,1.73 13.9,1.73 14.81,2.64 15.26,3.09 15.26,3.1 15.26,3.68 16.09,4.51 TP5.TP 16.6,4.76 16.6,6.1 16.6,6.65 17.15,7.2 J9.1
CONF_DONE  (via drill 0.1)
  Top 0.076: v10.64,18.53 11.17,18.53 U14.A2
  Bottom 0.076: R56.2 10.92,18.48 10.89,18.51 v10.64,18.53
  pour Bottom (no thermals): 10.56,18.53 arc180 10.72,18.53 arc180
  pour Top (no thermals): 10.56,18.53 arc180 10.72,18.53 arc180
CONFIG_SEL  (via drill 0.1)
  Top 0.051: U14.C6 10.5,17.2 10.5,18 10.37,18.13 10.14,18.13 9.29,18.13 9.16,18.13 8.78,18.51 v8.78,18.55
  Bottom 0.076: R57.1 v8.78,18.55
  pour Bottom (no thermals): 8.7,18.55 arc180 8.86,18.55 arc180
  pour Top (no thermals): 8.7,18.55 arc180 8.86,18.55 arc180
DAC_CS  (via drill 0.1, 0.1 layers 1-6)
  Route3 0.076: U14.A5 11.14,18.24 12.64,18.24 13.36,17.52 13.36,17.41 13.82,16.95 14.46,16.95 v15.38,16.17
  Bottom 0.076: U2.5 15.52,16.03 v15.38,16.17
  other vias: 10.7,17.8
  pour Route3 (no thermals): 15.3,16.17 arc180 15.46,16.17 arc180
  pour Bottom (no thermals): 15.3,16.17 arc180 15.46,16.17 arc180
  pour Route3 (no thermals): 10.62,17.8 arc180 10.78,17.8 arc180
DATA1  (via drill 0.1 layers 1-6)
  Route2/PWR 0.076: U14.C7 9.7,16.8 9.7,16.5 9.6,16.4 8.95,16.4 8.67,16.12 8.67,13.83 7.93,13.08 4.61,13.08 4.07,12.54 4.07,11.34 2.51,9.79 2.51,8.33 6.14,4.7 8.05,4.7 9.15,5.8 U6.C1
  other vias: 9.15,5.95 9.9,17
  pour Route2/PWR (no thermals): 9.07,5.95 arc180 9.23,5.95 arc180
  pour Route2/PWR (no thermals): 9.82,17 arc180 9.98,17 arc180
DATA2
  Top 0.051: U14.C3 11.7,17.2 12.36,17.2 12.37,17.19 12.38,17.19 12.54,17.02 12.77,17.02 13.09,16.7 13.65,16.7 U8.C1
DATA3
  Top 0.051: U14.A7 9.7,18 8.9,18 8.7,17.8 8.7,17.41 U11.C1
DATA4  (via drill 0.1 layers 1-6)
  Top 0.076: U12.C1 4.77,1.81 4.76,1.92 U12.C1
  Route3 0.076: U14.B6 9.42,18.28 7.31,18.28 6.73,17.71 5.87,17.71 5.87,17.7 5.63,17.7 3.67,15.75 3.42,15.75 2.27,14.6 2.27,14.17 1.76,13.66 1.76,12.81 1.18,12.23 1.18,10.7 1.18,7.26 | U12.C1 4.75,2.51 2.33,4.93 2.33,5.33 1.18,6.48 1.18,7.26 | 1.18,7.26
  other vias: 4.75,1.85 10.3,17.4
  pour Top (no thermals): 4.67,1.85 arc180 4.83,1.85 arc180
  pour Top (no thermals): 4.67,1.85 arc180 4.83,1.85 arc180
  pour Route3 (no thermals): 4.67,1.85 arc180 4.83,1.85 arc180
  pour Route3 (no thermals): 10.22,17.4 arc180 10.38,17.4 arc180
DIN0  (via drill 0.1 layers 1-6)
  Route3 0.076: U14.J6 10.3,14.35 10.5,14.15 10.5,13.2 9.53,12.23 7.53,12.23 5.95,10.65 5.95,10.15 5.7,9.9 5.7,8.35 6.08,7.97 6.08,7.29 6.56,6.79 8.7,6.79 8.8,6.89 10.95,6.89 U9.19
  other vias: 11.51,6.34 10.3,14.6
  pour Route3 (no thermals): 11.43,6.34 arc180 11.59,6.34 arc180
  pour Route3 (no thermals): 10.22,14.6 arc180 10.38,14.6 arc180
DIN1  (via drill 0.1 layers 1-6)
  Top 0.051: U14.G6 10.1,15.2 10.1,14.25 v10.3,14.05
  Route3 0.076: v10.3,14.05 10.3,13.35 9.38,12.43 7.33,12.43 5.7,10.8 5.7,10.3 5.5,10.1 5.5,8.2 5.85,7.85 5.85,7.23 6.47,6.61 8.73,6.61 8.8,6.61 8.88,6.69 10.33,6.69 10.66,6.36 10.99,6.36 U9.20
  other vias: 11.51,5.84
  pour Route3 (no thermals): 11.43,5.84 arc180 11.59,5.84 arc180
  pour Route3 (no thermals): 10.22,14.05 arc180 10.38,14.05 arc180
  pour Top (no thermals): 10.22,14.05 arc180 10.38,14.05 arc180
DIN2  (via drill 0.1 layers 1-6)
  Route3 0.076: U14.H7 10.1,14.8 10.1,14.1 9.9,13.9 9.9,13.35 9.15,12.6 8.65,12.6 8.6,12.66 7.16,12.66 5.45,10.95 5.45,10.35 5.25,10.15 5.25,8.1 5.68,7.67 5.68,7.1 6.34,6.44 9.1,6.44 9.4,6.14 10.14,6.14 10.44,5.84 11,5.84 U9.21
  other vias: 11.51,5.34 9.9,15
  pour Route3 (no thermals): 11.43,5.34 arc180 11.59,5.34 arc180
  pour Route3 (no thermals): 9.82,15 arc180 9.98,15 arc180
DIN3  (via drill 0.1 layers 1-6)
  Route3 0.076: U14.J7 9.9,14.2 8.6,12.9 7.1,12.9 5.15,10.95 5.15,10.35 5,10.2 5,8.05 5.45,7.6 5.45,7.05 6.27,6.23 8.4,6.23 9,5.63 9.8,5.63 10.4,5.03 11.32,5.03 U9.22
  other vias: 9.9,14.6 11.51,4.84
  pour Route3 (no thermals): 9.82,14.6 arc180 9.98,14.6 arc180
  pour Route3 (no thermals): 11.43,4.84 arc180 11.59,4.84 arc180
DIN4  (via drill 0.1 layers 1-6)
  Route3 0.076: U14.G8 9.31,15.21 7.91,15.21 7.75,15.37 6.28,15.37 4.91,14 4.91,13.5 3.9,12.49 3.9,11.2 3.7,11 3.7,7.48 6.04,5.14 6.58,4.6 11.25,4.6 U9.23
  other vias: 11.51,4.34 9.5,15.4
  pour Route3 (no thermals): 11.43,4.34 arc180 11.59,4.34 arc180
  pour Route3 (no thermals): 9.42,15.4 arc180 9.58,15.4 arc180
DIN5  (via drill 0.1 layers 1-6)
  Route3 0.076: U14.G9 8.67,15.4 8.07,16 6.45,16 3.7,13.25 3.7,11.42 3.4,11.12 3.4,7.37 6.42,4.35 11,4.35 U9.24
  other vias: 11.51,3.84 9.1,15.4
  pour Route3 (no thermals): 11.43,3.84 arc180 11.59,3.84 arc180
  pour Route3 (no thermals): 9.02,15.4 arc180 9.18,15.4 arc180
DIN6  (via drill 0.1 layers 1-6)
  Top 0.076: U14.F7
  Route3 0.076: U14.F7 9.71,15.61 8.79,15.61 8.17,16.23 6.29,16.23 3.46,13.4 3.46,12.19 3.14,11.87 3.14,6.7 5,4.84 5,4.43 5.42,4 6.2,4 6.39,3.81 7.88,3.81 8.2,3.5 12.35,3.5 U9.26
  other vias: 9.9,15.8 12.66,3.19
  pour Top (no thermals): 9.82,15.8 arc180 9.98,15.8 arc180
  pour Route3 (no thermals): 9.82,15.8 arc180 9.98,15.8 arc180
  pour Route3 (no thermals): 12.58,3.19 arc180 12.74,3.19 arc180
DIN7  (via drill 0.1 layers 1-6)
  Route3 0.076: U9.27 12.86,2.89 12.49,2.89 12.16,2.56 7.6,2.56 7.35,2.81 6.24,2.81 2.51,6.54 2.51,7.17 2.86,7.51 2.86,7.69 2.58,7.97 2.58,12.12 2.84,12.39 2.84,13.21 6.07,16.45 8.25,16.45 8.7,16 9.7,16 U14.E7
  other vias: 13.16,3.19 9.9,16.2
  pour Route3 (no thermals): 13.08,3.19 arc180 13.24,3.19 arc180
  pour Route3 (no thermals): 9.82,16.2 arc180 9.98,16.2 arc180
DIN8  (via drill 0.1 layers 1-6)
  Top 0.076: U9.29 14.16,3.38 v14.01,3.38
  Route3 0.076: U14.E8 9.3,16.4 8.68,16.4 8.25,16.82 7.3,16.82 7.23,16.89 6.09,16.89 4.25,15.05 3.71,15.05 2.86,14.2 2.86,13.78 2.61,13.53 2.61,12.52 2.17,12.08 2.17,8.64 2.02,8.48 2.02,7.37 2.25,7.14 2.25,6.25 6.16,2.33 7.15,2.33 12.96,2.33 v14.01,3.38
  other vias: 9.5,16.2
  pour Top (no thermals): 13.93,3.39 arc180 14.09,3.39 arc180
  pour Route3 (no thermals): 13.93,3.39 arc180 14.09,3.39 arc180
  pour Route3 (no thermals): 9.42,16.2 arc180 9.58,16.2 arc180
DIN9  (via drill 0.1 layers 1-6)
  Route3 0.076: U14.C8 8.72,17 8.45,17.27 5.86,17.27 3.88,15.29 3.54,15.29 2.68,14.43 2.68,14.03 2.22,13.57 2.22,12.47 1.64,11.89 1.64,11.01 1.9,10.75 1.9,8.85 1.83,8.78 1.83,6.38 6.04,2.16 13.63,2.16 U9.30
  other vias: 14.66,3.19 9.5,17
  pour Route3 (no thermals): 14.58,3.19 arc180 14.74,3.19 arc180
  pour Route3 (no thermals): 9.42,17 arc180 9.58,17 arc180
DIN10  (via drill 0.1 layers 1-6)
  Top 0.076: U9.31 v15.16,3.49
  Route3 0.076: U14.C5 10.9,16.8 10.9,13.5 12.75,11.65 13.3,11.65 16.05,8.9 16.05,6.35 15.65,5.95 15.65,4.55 15.16,4.06 v15.16,3.49
  other vias: 10.7,17
  pour Route3 (no thermals): 15.08,3.49 arc180 15.24,3.49 arc180
  pour Top (no thermals): 15.08,3.49 arc180 15.24,3.49 arc180
  pour Route3 (no thermals): 10.62,17 arc180 10.78,17 arc180
DIN11  (via drill 0.1 layers 1-6)
  Top 0.076: 15.66,3.25 U9.32 15.66,3.55 v15.47,3.74
  Route3 0.076: v15.47,3.74 15.47,4.05 15.82,4.4 15.82,5.55 16.25,5.98 16.25,9.05 12.8,12.5 12.4,12.5 11.3,13.6 11.3,15.5 11.41,15.61 11.58,15.61 11.69,15.72 11.69,16.41 U14.C4
  other vias: 11.1,17
  pour Route3 (no thermals): 15.39,3.74 arc180 15.54,3.74 arc180
  pour Top (no thermals): 15.39,3.74 arc180 15.54,3.74 arc180
  pour Route3 (no thermals): 11.02,17 arc180 11.18,17 arc180
E0
  Bottom 0.051: J8.2 15.9,8.5 15.6,8.2 15.6,5.33 13.53,3.25 13.25,3.25 U7.K2
E1
  Bottom 0.051: J8.68 15.5,11.7 15.7,11.5 15.7,8.5 15.47,8.28 15.47,5.47 U7.J1
E2
  Bottom 0.051: J8.3 15.5,8.5 15.35,8.35 15.35,5.58 13.53,3.75 13.25,3.75 U7.J2
E3
  Bottom 0.051: J8.67 15.1,11.7 15.3,11.5 15.3,8.5 15.22,8.43 15.22,5.72 U7.H1
E4
  Bottom 0.051: J8.4 15.1,5.83 13.53,4.25 13.25,4.25 U7.H2
E5
  Bottom 0.051: J8.66 14.7,11.7 14.9,11.5 14.9,8.4 14.97,8.32 14.97,5.97 U7.G1
E6
  Bottom 0.051: J8.5 14.7,8.4 14.85,8.25 14.85,6.08 13.53,4.75 13.25,4.75 U7.G2
E7
  Bottom 0.051: J8.65 14.3,11.7 14.5,11.5 14.5,8.4 14.72,8.18 14.72,6.22 U7.F1
E8
  Bottom 0.051: J8.6 14.3,8.4 14.6,8.1 14.6,6.33 13.53,5.25 13.25,5.25 U7.F2
E9
  Bottom 0.051: J8.64 13.9,11.7 14.1,11.5 14.1,8.4 14.47,8.03 14.47,6.47 U7.E1
E10
  Bottom 0.051: J8.7 13.9,8.4 14.35,7.95 14.35,6.58 13.53,5.75 13.25,5.75 U7.E2
E11
  Bottom 0.051: J8.63 13.5,11.7 13.7,11.5 13.7,8.4 14.22,7.88 14.22,6.72 U7.D1
E12
  Bottom 0.051: J8.8 13.5,8.4 14.1,7.8 14.1,6.83 13.53,6.25 13.25,6.25 U7.D2
E13
  Bottom 0.051: J8.62 13.1,11.7 13.3,11.5 13.3,8.4 13.97,7.72 13.97,6.97 U7.C1
E14
  Bottom 0.051: J8.9 13.1,8.4 13.85,7.65 13.85,7.1 13.5,6.75 13.25,6.75 U7.C2
E15
  Bottom 0.051: J8.61 12.7,11.7 12.9,11.5 12.9,8.38 13.72,7.55 13.72,7.22 U7.B1
E16
  Bottom 0.051: U7.A1 12.7,8.3 J8.10
E17
  Bottom 0.051: J8.60 12.3,11.7 12.5,11.5 12.5,8.3 13.25,7.55 13.25,7.25 U7.B2
E18
  Bottom 0.051: U7.A2 12.3,8.2 J8.11
E19
  Bottom 0.051: J8.59 11.9,11.7 12.1,11.5 12.1,8.2 12.75,7.55 12.75,7.25 U7.B3
E20
  Bottom 0.051: U7.A3 11.9,8.1 J8.12
E21
  Bottom 0.051: J8.58 11.5,11.7 11.7,11.5 11.7,8.1 12.25,7.55 12.25,7.25 U7.B4
E22
  Bottom 0.051: U7.A4 11.5,8 J8.13
E23
  Bottom 0.051: J8.57 11.1,11.7 11.3,11.5 11.3,8 11.75,7.55 11.75,7.25 U7.B5
E24
  Bottom 0.051: U7.A5 11.1,7.9 J8.14
E25
  Bottom 0.051: J8.56 10.7,11.7 10.9,11.5 10.9,7.9 11.25,7.55 11.25,7.25 U7.B6
E26
  Bottom 0.051: U7.A6 10.7,7.8 J8.15
E27
  Bottom 0.051: J8.55 10.3,11.7 10.5,11.5 10.5,7.8 10.75,7.55 10.75,7.25 U7.B7
E28
  Bottom 0.051: U7.A7 10.3,7.7 J8.16
E29
  Bottom 0.051: J8.54 9.9,11.7 10.1,11.5 10.1,7.7 10.25,7.55 10.25,7.25 U7.B8
E30
  Bottom 0.051: U7.A8 9.9,7.6 J8.17
E31
  Bottom 0.051: J8.53 9.5,11.7 9.7,11.5 9.7,7.2 U7.B9
E32
  Bottom 0.051: J8.18 U7.A9
E33
  Bottom 0.051: J8.52 9.1,11.7 9.3,11.5 9.3,7.8 U7.A10
E34
  Bottom 0.051: J8.19 9.1,7.9 8.75,7.55 8.75,7.25 U7.B10
E35
  Bottom 0.051: J8.51 8.7,11.7 8.9,11.5 8.9,7.9 U7.A11
E36
  Bottom 0.051: J8.20 8.7,8 8.25,7.55 8.25,7.25 U7.B11
E37
  Bottom 0.051: J8.50 8.3,11.7 8.5,11.5 8.5,8 U7.A12
E38
  Bottom 0.051: J8.21 8.3,8.1 7.75,7.55 7.75,7.25 U7.B12
E39
  Bottom 0.051: J8.49 7.9,11.7 8.1,11.5 8.1,8.1 U7.A13
E40
  Bottom 0.051: J8.22 7.9,8.2 7.25,7.55 7.25,7.25 U7.B13
E41
  Bottom 0.051: J8.48 7.5,11.7 7.7,11.5 7.7,8.2 U7.A14
E42
  Bottom 0.051: J8.23 7.5,8.3 6.75,7.55 6.75,7.25 U7.B14
E43
  Bottom 0.051: J8.47 7.1,11.7 7.3,11.5 7.3,8.3 U7.A15
E44
  Bottom 0.051: J8.24 7.1,8.4 6.25,7.55 6.25,7.25 U7.B15
E45
  Bottom 0.051: J8.46 6.7,11.7 6.9,11.5 6.9,8.4 U7.A16
E46
  Bottom 0.051: J8.25 6.7,8.5 5.75,7.55 5.75,7.25 U7.B16
E47
  Bottom 0.051: J8.45 6.3,11.7 6.5,11.5 6.5,8.5 U7.A17
E48
  Bottom 0.051: J8.26 6.3,8.55 5.3,7.55 5.3,7.2 U7.B17
E49
  Bottom 0.051: J8.44 5.9,11.7 6.1,11.5 6.1,8.5 5.17,7.58 5.17,7.05 5.4,6.82 5.68,6.82 U7.C16
E50
  Bottom 0.051: J8.27 5.9,8.5 5.05,7.65 5.05,6.95 U7.C17
E51
  Bottom 0.051: J8.43 5.5,11.7 5.7,11.5 5.7,8.5 4.92,7.72 4.92,6.83 5.5,6.25 5.75,6.25 U7.D16
E52
  Bottom 0.051: J8.28 5.5,8.5 4.8,7.8 4.8,6.7 U7.D17
E53
  Bottom 0.051: J8.42 5.1,11.7 5.3,11.5 5.3,8.5 4.67,7.88 4.67,6.58 5.5,5.75 5.75,5.75 U7.E16
E54
  Bottom 0.051: J8.29 5.1,8.5 4.55,7.95 4.55,6.45 U7.E17
E55
  Bottom 0.051: J8.41 4.7,11.7 4.9,11.5 4.9,8.5 4.42,8.03 4.42,6.33 5.5,5.25 5.75,5.25 U7.F16
E56
  Bottom 0.051: J8.30 4.7,8.5 4.3,8.1 4.3,6.2 U7.F17
E57
  Bottom 0.051: J8.40 4.3,11.7 4.5,11.5 4.5,8.5 4.17,8.18 4.17,6.08 5.5,4.75 5.75,4.75 U7.G16
E58
  Bottom 0.051: J8.31 4.3,8.5 4.05,8.25 4.05,5.95 U7.G17
E59
  Bottom 0.051: J8.39 3.9,11.7 4.1,11.5 4.1,8.5 3.92,8.32 3.92,5.83 5.5,4.25 5.75,4.25 U7.H16
E60
  Bottom 0.051: J8.32 3.9,8.5 3.8,8.4 3.8,5.72 U7.H17
E61
  Bottom 0.051: J8.38 3.5,11.7 3.7,11.5 3.7,8.5 3.67,8.43 3.67,5.58 5.5,3.75 5.75,3.75 U7.J16
E62
  Bottom 0.051: J8.33 3.55,8.91 3.55,5.45 U7.J17
E63
  Bottom 0.051: J8.37 3.1,11.7 3.3,11.5 3.3,8.5 3.42,8.38 3.42,5.33 5.5,3.25 5.75,3.25 U7.K16
ENV1  (via drill 0.1 layers 1-6)
  Route2/PWR 0.076: U14.B5 10.5,17.6 8.9,17.6 8.15,16.86 8.15,16.34 7.68,15.86 7.68,15.32 7.96,15.05 7.96,14.17 7.17,13.39 4.18,13.39 3.7,12.91 3.7,11.4 3.16,10.86 2.78,10.86 1.61,9.68 1.61,4.73 2.89,3.45 5.24,3.45 6.27,4.48 8.44,4.48 9.65,5.69 U6.C2
  other vias: 9.65,5.95 10.7,17.4
  pour Route2/PWR (no thermals): 9.57,5.95 arc180 9.73,5.95 arc180
  pour Route2/PWR (no thermals): 10.62,17.4 arc180 10.78,17.4 arc180
ENV2  (via drill 0.1 layers 1-6)
  Top 0.076: v13.25,16.17 13.27,16.15 U8.C2
  Route3 0.076: U14.C2 12.06,16.84 12.58,16.84 v13.25,16.17
  other vias: 11.9,17
  pour Route3 (no thermals): 13.17,16.17 arc180 13.33,16.17 arc180
  pour Top (no thermals): 13.17,16.17 arc180 13.33,16.17 arc180
  pour Route3 (no thermals): 11.82,17 arc180 11.98,17 arc180
ENV3  (via drill 0.1 layers 1-6)
  Top 0.1: v7.65,17.07 7.85,17.07
  Top 0.102: 7.85,17.07 U11.C2
  Route3 0.076: v7.65,17.07 8.3,17.07 8.77,16.6 U14.D9
  other vias: 9.1,16.6
  pour Route3 (no thermals): 9.02,16.6 arc180 9.18,16.6 arc180
  pour Route3 (no thermals): 7.57,17.07 arc180 7.72,17.07 arc180
  pour Top (no thermals): 7.57,17.07 arc180 7.72,17.07 arc180
ENV4  (via drill 0.1 layers 1-6)
  Route3 0.076: U14.B7 9.7,17.2 8.93,17.2 8.65,17.48 5.75,17.48 3.75,15.48 3.45,15.48 2.46,14.49 2.46,14.06 1.98,13.58 1.98,12.57 1.4,12 1.4,10.59 1.49,10.49 1.49,8.8 1.5,8.8 1.6,8.7 1.6,8.21 1.49,8.1 1.49,6.41 5.25,2.66 U12.C2
  other vias: 5.25,1.85 9.9,17.4
  pour Route3 (no thermals): 5.17,1.85 arc180 5.33,1.85 arc180
  pour Route3 (no thermals): 9.82,17.4 arc180 9.98,17.4 arc180
ESTIM_POW_EN  (via drill 0.1 layers 1-6)
  Top 0.076: 1.87,12.66 R49.1 2.01,12.66 U16.9 U16.8 v2.42,13.16
  Route2/PWR 0.076: v2.42,13.16 2.42,13.18 2.45,13.2 3.21,13.2 3.95,13.94 7.34,13.94 7.78,14.38 7.78,14.92 7.29,15.41 7.29,15.86 7.91,16.47 7.91,17.22 8.69,18 10.1,18 U14.A6
  other vias: 10.3,17.8
  pour Route2/PWR (no thermals): 10.22,17.8 arc180 10.38,17.8 arc180
  pour Route2/PWR (no thermals): 2.34,13.16 arc180 2.5,13.16 arc180
  pour Top (no thermals): 2.34,13.16 arc180 2.5,13.16 arc180
GND  (via drill 0.08 layers 1-6, 0.1, 0.1 layers 1-6, 0.15 layers 1-6, 0.2, 0.2 layers 1-6, 0.3 layers 1-6)
  Top 0.051: 10.28,15.69 10.23,15.72 v10.16,15.66 | U14.F6 10.3,15.7 | 13.3,17.28 R26.1 | 1.2,12.16 R46.1 | C16.2 v14.23,9.2 | 16.25,6.9 U9.7 | U9.PAD v14.25,5.25 | v17.82,7.7 18.1,7.7 TP3.TP | R43.2 8.23,15.97
  Top 0.076: U3.1 5.52,7.56 | 4.1,13.36 U16.PAD v3.92,12.78 | v14.23,9.2 C15.2 | 13.12,2.57 C20.2 | C21.2 11.32,2.67 11.4,2.69 | C22.2 v10.16,7.55 v10.15,7.54 | R46.1 1.04,12.14 v0.98,12.08 | v17.68,6.3 R30.2 | v4.41,5.84 U3.PAD 5.29,5.59 5.51,6.21 5.51,6.52 5.58,6.6 6.86,6.6 U4.8 | 13.66,17.26 C28.2 | v17.31,11.71 17.31,11.87 U20.PAD | C34.2 6.72,15.34 | 6.72,15.34 | U10.2 v7.89,0.52 v7.89,0.53 | U10.18 v8.8,5.11 U10.17 | 6.4,0.93 C35.2 | U10.15 10.14,5.06 v10.01,5.03 | 9.71,7.65 C19.2 | v10.85,6.57 C23.2 | C18.2 v10.85,6.05 | v10.86,2.75 C33.1 | v8,15.76 8.12,15.88 R43.2 | U10.25 v7.05,2.57
  Top 0.1: U14.F4 v11.2,15.7 | C27.2 13.96,14.3 v13.96,14.34
  Top 0.15: v11.2,15.7 U14.E5 U14.F6 v10.16,15.66 | 5.81,2.34 U12.B3 U12.B2 v5.49,2.34 v5.5,2.35 | v4.32,2.06 4.24,2.06 C36.2 | U14.A1 12.26,17.76 v12.2,17.8
  Top 0.2: 9.97,12.34 C40.2 | 9.97,12.34 C39.2 | 9.97,12.34 10.1,12.21 U15.2 10.9,11.81 U15.PAD | 11.92,12.91 C56.2 | 12.82,11.87 U17.PAD 12.97,11.82 v13.05,11.87 | 5.52,7.56 5.52,6.86 U3.PAD | U8.B3 U8.B2 | 16.8,9.65 C11.2 | U9.7 16.29,6.85 15.76,6.85 15.1,6.85 15,6.75 v15,6 15.34,6.33 U9.6 | C14.2 14.18,1.98 v14.12,2.04 | v12.9,2.59 13.1,2.59 13.12,2.57 | v11.34,2.76 v11.34,2.75 11.4,2.69 | v15.47,8.86 15.53,8.92 C17.2 15.29,9.04 v15.26,9.07 | v17.75,8.39 17.75,8.53 C12.2 | U11.B3 U11.B2 | C7.2 v1.68,10.59 | v1.4,8.56 C6.2 | v3.9,16.33 3.9,16.13 C64.2 | C28.2 v13.55,17.49 13.55,17.26 R26.1 | v0.96,12.78 1.25,12.78 R49.2 | v6.23,17.99 7,18.24 C32.2 | U4.4 8.8,6.06 v8.8,5.11 | C13.2 15.43,2.56 v15.6,2.53 | v6.71,15.59 6.83,15.47 C34.2 | v7.49,15.59 7.44,15.54 R36.1 | C33.1 v10.86,2.75 | C35.2 6.4,1.02 v6.38,1.04 | C31.2 6.54,2.1 7,2.56 U10.25 | v10.85,4.82 v10.85,4.81 R42.1 | C23.2 v10.86,6.57 | C19.2 v9.69,7.68
  Bottom 0.051: 2.9,12.54 3.06,12.54 3.12,12.6 | 3.1,12.5 3.17,12.5 v3.26,12.59 | 2.9,11.7 2.9,12.54 | 2.9,12.54 2.46,12.54 2.4,12.6
  Bottom 0.15: C59.2 v10.16,15.66 | C60.2 v11.2,15.7
  Bottom 0.2: v13.55,17.49 13.55,17.39 C3.2 13.55,17.45 13.9,17.1 13.9,17 U2.3 | C77.2 v0.5,8.8 | U5.2 15.72,14.4 v15.77,14.35 | C68.2 12.18,16.38 C62.2 | C42.2 1.77,12.87 1.6,12.7 1.17,12.7 L7.1
  other vias: 9.1,15 12.3,15 9.9,16.6 11.1,17.4 9.1,17.8 10.7,16.2 12.3,16.6 3.26,12.32 7.35,17.05 16.31,12.66 15.69,13.59 16.51,12.14 14.15,16.15 3.48,6.8 4.4,4.36 4.73,5.53 1.32,13.7 13.96,15.56 15.68,13.31 11.99,13.35 17.04,12.08 15.95,12.63 12.04,12.01 11.86,12.18 15.89,13.45 3.02,5.76 5.38,4.9 5.34,4.45 15.92,13.22 16.01,12.97 16.16,13.37 16.68,13.14 12.21,13.28 11.69,12.37 15.43,13.35 15.34,12.16 14.61,13.03 17.51,11.91 17.22,12.3 16.78,12.29 15.45,13.12 16.74,12.75 16.57,12.92 3.16,13.81 4.6,12.22 4.6,12.77 4.62,13.63 3.75,6.49 15.38,13.64 16.44,13.36 10.7,15 6.47,4 15.63,12.77 12.25,9.35 12.75,6.75 12.2,8.5 11.49,12.62 12.58,12.7 13.5,6.75 14.25,6.75 12.75,6 13.5,6 14.25,6 12.75,5.25 13.5,5.25 15,5.25 12.75,4.5 13.5,4.5 14.25,4.5 11.45,8.5 10.63,8.5 10.3,8.7 11.95,9.15 11.35,9.2 10.79,9.26 9.04,8.8 8.85,9.15 9.87,10.76 11.7,16.8 8.55,9.18 7.57,10.78 8.98,10.53 10.79,10.64 10.78,9.91 11.81,9.62 12.03,10.61 9.8,8.82 7.66,8.76 6.66,8.65 3.93,4.84 3.48,5.3 4.08,6.18 5.04,5.2 4.17,4.6 3.26,5.52 3.7,5.07 3.12,4.44 3.36,4.27 2.95,4.67 5.55,4.27 6.71,8.27 11.24,10.6 15.72,13.01 9.3,13.09 8.98,12.79 8.18,17.82 9.1,16.2 8.29,10.57 6.67,10.57 10.39,12.27 10.1,12.07 10.95,11.98 10.92,11.54 11.13,11.77 10.74,11.78 10.42,11.98 12.8,11.93 14.6,12.37 15.3,12.43 15.67,12.46 16.03,12.12 16.21,12.39 17.02,12.49 16.59,12.53 16.33,12.98 15.69,12.08 14.6,12.72 10.75,12.31 10.69,12.04 3.25,12.91 3.34,13.99 4.22,13.15 4.33,12.49 18.26,11.06 11.25,9.75 12.1,9.95 8.36,8.91 8.91,8.26 6.7,9.05 8.98,9.86 8.34,9.42 3.63,16.2 13.8,14.54 2.04,14.97 3.46,14.53 10.58,12.61 12.56,17.29 10.2,0.56 9.39,0.51 9.39,5.11 9.65,6.45 10.15,6.45 4.62,4.77 3.24,6.17 4.15,5.25 3.7,5.71 4.39,5.01 3.48,5.93 3.92,5.48 3.02,6.39 0.42,11
  pour GND2 (isolate 0.02, rank 2): -2.4,-0.5 -2.4,11.78 5.12,19.3 13.62,19.3 21.2,11.72 21.2,-0.5
  pour Top (isolate 0.1, rank 4, no thermals): 8.15,13.62 8.15,12.54 9.2,12.54 9.58,12.16 9.58,11.84 13.3,11.84 13.3,13.62